# EAGLE design KMO_IO_MV8 (EAGLE 9.1.3)

## Sheet 1 of 2
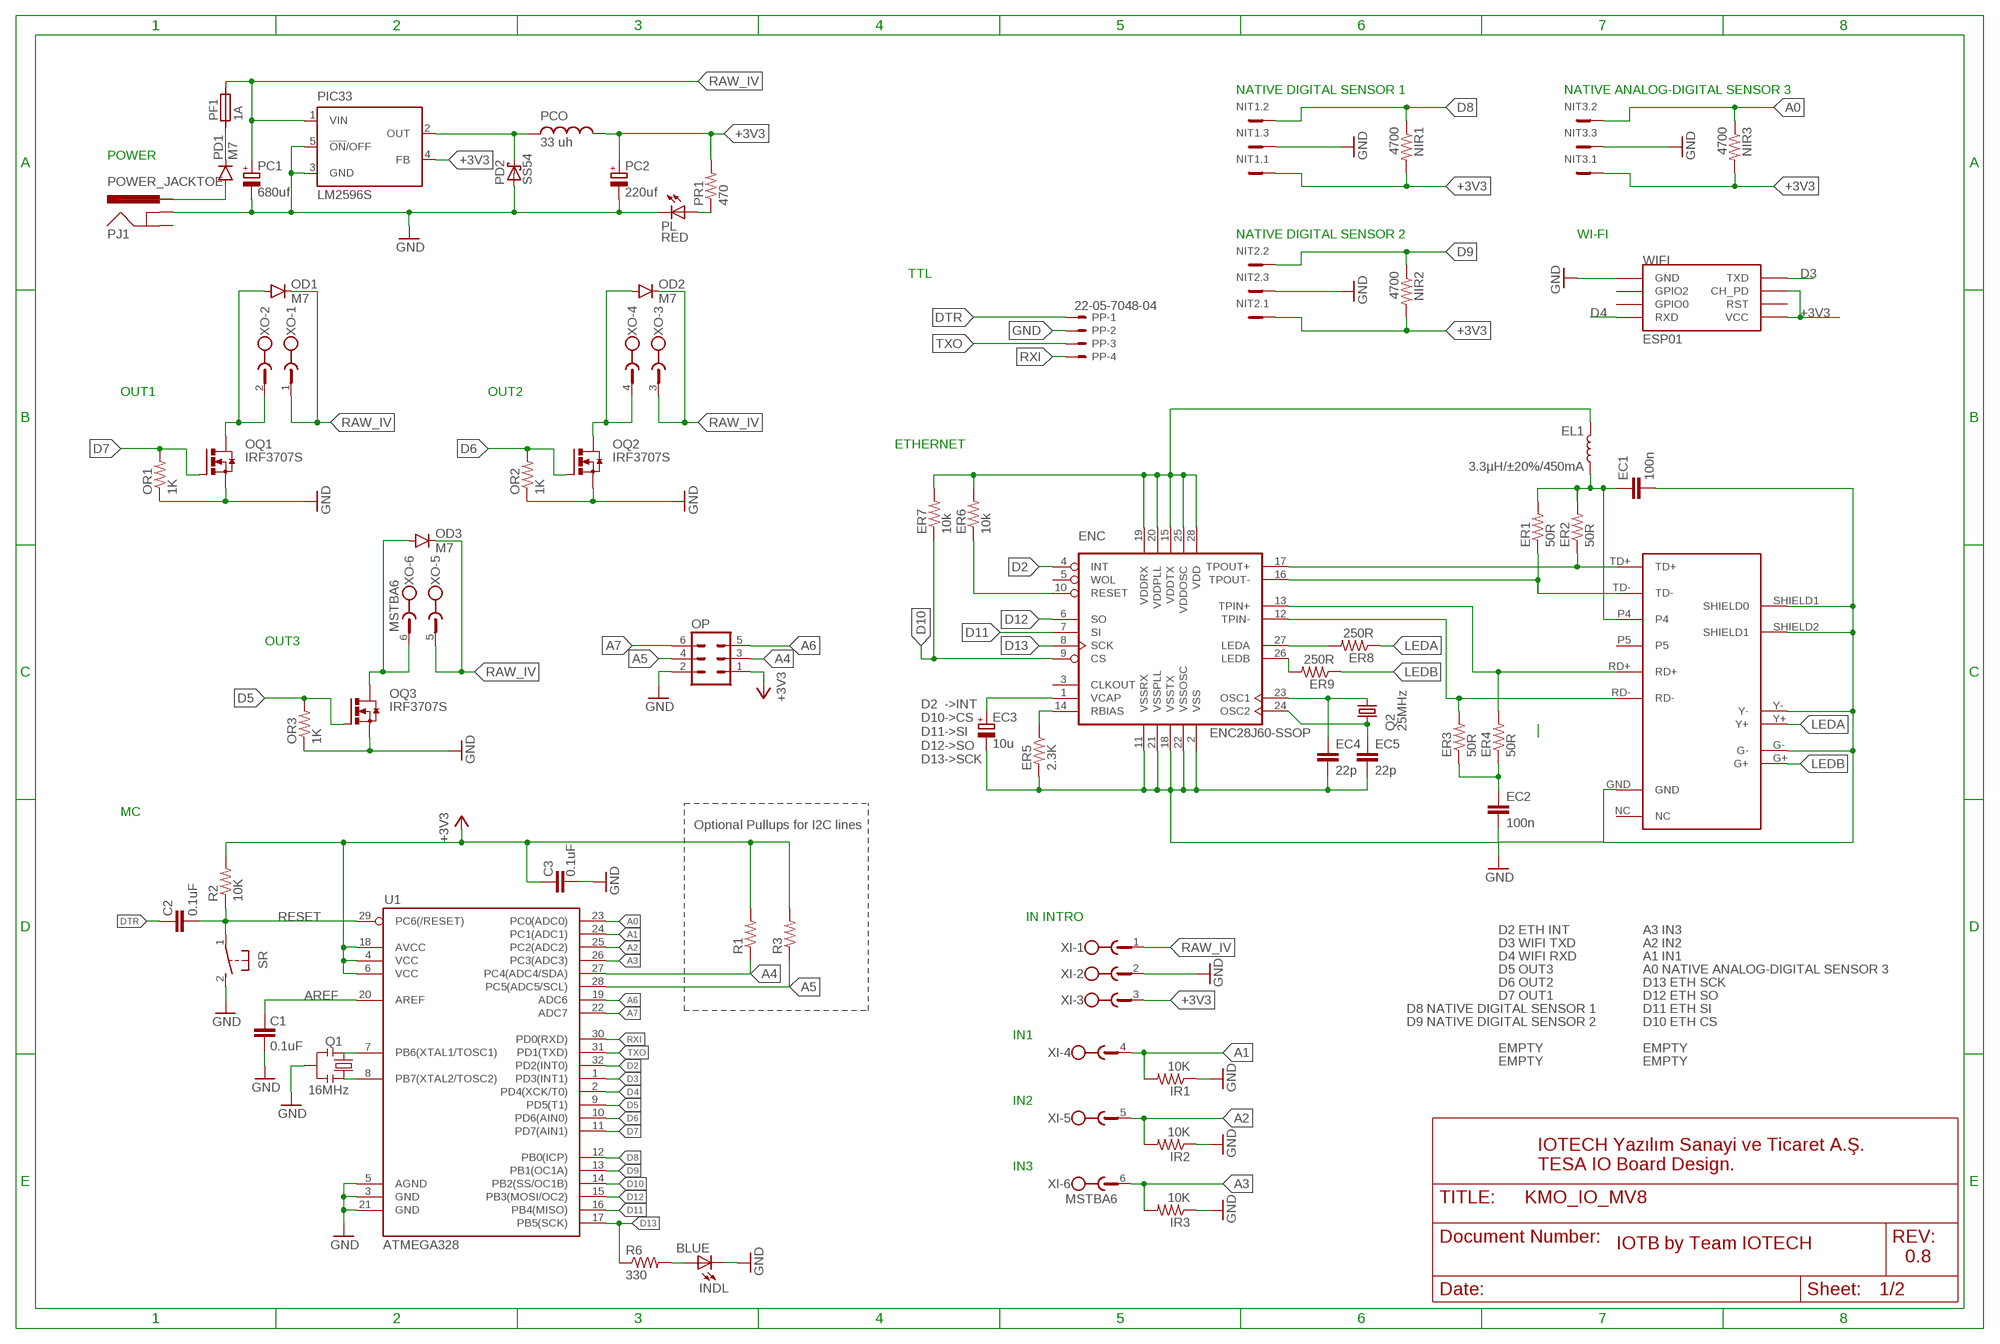
[diagram p0: schematic, sheet 1]

### Parts
C1  0.1uF  CAP0805  [0805]
C2  0.1uF  CAP0805  [0805]
C3  0.1uF  CAP0805  [0805]
EC1  100n  CAP0805  [0805]
EC2  100n  CAP0805  [0805]
EC3  10u  CPOL-EUCT3216  [CT3216]
EC4  22p  CAP0805  [0805]
EC5  22p  CAP0805  [0805]
EL1  3.3µH/±20%/450mA  INDUCTOR-0805-3.3UH  [0805]
ENC  ENC28J60-SSOP  [SSOP28]
ER1  50R  RESISTOR0805-RES  [0805]
ER2  50R  RESISTOR0805-RES  [0805]
ER3  50R  RESISTOR0805-RES  [0805]
ER4  50R  RESISTOR0805-RES  [0805]
ER5  2.3K  RESISTOR0805-RES  [0805]
ER6  10k  RESISTOR0805-RES  [0805]
ER7  10k  RESISTOR0805-RES  [0805]
ER8  250R  RESISTOR0805-RES  [0805]
ER9  250R  RESISTOR0805-RES  [0805]
INDL  BLUE  LEDCHIP-LED0805  [CHIP-LED0805]
IR1  10K  RESISTOR0805-RES  [0805]
IR2  10K  RESISTOR0805-RES  [0805]
IR3  10K  RESISTOR0805-RES  [0805]
NIR1  4700  RESISTOR0805-RES  [0805]
NIR2  4700  RESISTOR0805-RES  [0805]
NIR3  4700  RESISTOR0805-RES  [0805]
NIT1  MC3  [MC3]
NIT2  MC3  [MC3]
NIT3  MC3  [MC3]
OD1  M7  DIODESMA  [SMA-DIODE]
OD2  M7  DIODESMA  [SMA-DIODE]
OD3  M7  DIODESMA  [SMA-DIODE]
OP  MA03-2  [MA03-2]
OQ1  IRF3707S  IRF3704S  [D2PACK]
OQ2  IRF3707S  IRF3704S  [D2PACK]
OQ3  IRF3707S  IRF3704S  [D2PACK]
OR1  1K  RESISTOR0805-RES  [0805]
OR2  1K  RESISTOR0805-RES  [0805]
OR3  1K  RESISTOR0805-RES  [0805]
PC1  680uf  CPOL-EU140CLH-1010  [140CLH-1010]
PC2  220uf  CPOL-EU140CLH-1010  [140CLH-1010]
PCO  33 uh  MSS1260  [MSS1260]
PD1  M7  DIODESMA  [SMA-DIODE]
PD2  SS54  SCHOTTKY-DIODESMD  [SMB]
PF1  1A  SIBA194600  [1820]
PIC33  LM2596S  [TO263-5]
PJ1  POWER_JACKTOE  [POWER_JACK_SMD_OVERPASTE_TOE]
PL  RED  LEDCHIP-LED0805  [CHIP-LED0805]
PP  22-05-7048-04  [7395-04]
PR1  470  RESISTOR0805-RES  [0805]
Q1  16MHz  RESONATOR1:1  [RESONATOR-SMD-1:1]
Q2  25MHz  KX-9B  [5.0X3.2_2]
R1  RESISTOR0805-RES  [0805]
R2  10K  RESISTOR0805-RES  [0805]
R3  RESISTOR0805-RES  [0805]
R6  330  RESISTOR0805-RES  [0805]
SR  31-XX  [B3F-31XX]
U1  ATMEGA328  ATMEGA168  [TQFP32-08]
U$2  HR911105A  [RJ45]
WIFI  ESP01  [ESP01]
XI  MSTBA6  [MSTBA6]
XO  MSTBA6  [MSTBA6]

### Nets
+3V3: C3.2 EL1.1 ENC.15(VDDTX) ENC.19(VDDRX) ENC.20(VDDPLL) ENC.25(VDDOSC) ENC.28(VDD) ER6.2 ER7.2 NIR1.2 NIR2.2 NIR3.2 NIT1.1 NIT2.1 NIT3.1 OP.1 PC2.+ PCO.P$1 PIC33.4(FB) PR1.2 R1.2 R2.2 R3.2 U1.4(VCC) U1.6(VCC) U1.18(AVCC) WIFI.CH_PD WIFI.VCC XI.3
A0: NIR3.1 NIT3.2 U1.23(PC0(ADC0))
A1: IR1.2 U1.24(PC1(ADC1)) XI.4
A2: IR2.2 U1.25(PC2(ADC2)) XI.5
A3: IR3.2 U1.26(PC3(ADC3)) XI.6
A4: OP.3 R1.1 U1.27(PC4(ADC4/SDA))
A5: OP.4 R3.1 U1.28(PC5(ADC5/SCL))
A6: OP.5 U1.19(ADC6)
A7: OP.6 U1.22(ADC7)
AREF: C1.2 U1.20(AREF)
D2: ENC.4(INT) U1.32(PD2(INT0))
D3: U1.1(PD3(INT1)) WIFI.TX(TXD)
D4: U1.2(PD4(XCK/T0)) WIFI.RX(RXD)
D5: OQ3.1(G) OR3.2 U1.9(PD5(T1))
D6: OQ2.1(G) OR2.2 U1.10(PD6(AIN0))
D7: OQ1.1(G) OR1.2 U1.11(PD7(AIN1))
D8: NIR1.1 NIT1.2 U1.12(PB0(ICP))
D9: NIR2.1 NIT2.2 U1.13(PB1(OC1A))
D10: ENC.9(CS) ER7.1 U1.14(PB2(SS/OC1B))
D11: ENC.7(SI) U1.16(PB4(MISO))
D12: ENC.6(SO) U1.15(PB3(MOSI/OC2))
D13: ENC.8(SCK) R6.1 U1.17(PB5(SCK))
DTR: C2.2 PP.1
EP4: EC1.1 EL1.2 ER1.2 ER2.2 U$2.P4
GND: C1.1 C3.1 EC1.2 EC2.2 EC3.- EC4.2 EC5.2 ENC.2(VSS) ENC.11(VSSRX) ENC.18(VSSTX) ENC.21(VSSPLL) ENC.22(VSSOSC) ER5.2 INDL.C IR1.1 IR2.1 IR3.1 NIT1.3 NIT2.3 NIT3.3 OP.2 OQ1.3(S) OQ2.3(S) OQ3.3(S) OR1.1 OR2.1 OR3.1 PC1.- PC2.- PD2.A PIC33.3(GND) PIC33.5(!ON!/OFF) PJ1.GND(GNDBREAK) PL.C PP.2 Q1.2 SR.2(S) U1.3(GND) U1.5(AGND) U1.21(GND) U$2.G- U$2.GND U$2.SHIELD1(SHIELD0) U$2.SHIELD2(SHIELD1) U$2.Y- WIFI.GND XI.2
LEDA: ER8.1 U$2.Y+
LEDB: ER9.1 U$2.G+
N$1: OD3.A OQ3.2(D) XO.6
N$2: PD1.C PF1.1
N$3: OD1.A OQ1.2(D) XO.2
N$4: OD2.A OQ2.2(D) XO.4
N$5: INDL.A R6.2
N$6: EC2.1 ER3.1 ER4.1
N$9: ENC.27(LEDA) ER8.2
N$10: Q1.3 U1.8(PB7(XTAL2/TOSC2))
N$11: PL.A PR1.1
N$13: EC3.+ ENC.1(VCAP)
N$14: ENC.26(LEDB) ER9.2
N$15: Q1.1 U1.7(PB6(XTAL1/TOSC1))
N$16: PCO.P$2 PD2.C PIC33.2(OUT)
N$17: ENC.10(RESET) ER6.1
N$18: PD1.A PJ1.VIN0(PWR)
N$19: ENC.14(RBIAS) ER5.1
N$22: EC5.1 ENC.24(OSC2) Q2.1
N$24: EC4.1 ENC.23(OSC1) Q2.2
RAW_IV [vcc]: OD1.C OD2.C OD3.C PC1.+ PF1.2 PIC33.1(VIN) XI.1 XO.1 XO.3 XO.5
RD+: ENC.13(TPIN+) ER4.2 U$2.RD+
RD-: ENC.12(TPIN-) ER3.2 U$2.RD-
RESET: C2.1 R2.1 SR.1(P) U1.29(PC6(/RESET))
RXI: PP.4 U1.30(PD0(RXD))
TD+: ENC.17(TPOUT+) ER2.1 U$2.TD+
TD-: ENC.16(TPOUT-) ER1.1 U$2.TD-
TXO: PP.3 U1.31(PD1(TXD))
Unconnected: ENC.3(CLKOUT) ENC.5(WOL) PJ1.P$4(GND) U$2.NC U$2.P5 WIFI.GPIO0 WIFI.GPIO2 WIFI.RST

### Notes on the sheet
- NATIVE DIGITAL SENSOR 1 | NATIVE ANALOG-DIGITAL SENSOR 3
- POWER
- NATIVE DIGITAL SENSOR 2 | WI-FI
- TTL
- OUT1 | OUT2
- ETHERNET
- OUT3
- D2  ->INT
  D10->CS
  D11->SI
  D12->SO
  D13->SCK
- MC
- Optional Pullups for I2C lines
- IN INTRO
- D2 ETH INT | A3 IN3
- D3 WIFI TXD | A2 IN2
- D4 WIFI RXD | A1 IN1
- D5 OUT3 | A0 NATIVE ANALOG-DIGITAL SENSOR 3
- D6 OUT2 | D13 ETH SCK
- D7 OUT1 | D12 ETH SO
- D8 NATIVE DIGITAL SENSOR 1 | D11 ETH SI
- D9 NATIVE DIGITAL SENSOR 2 | D10 ETH CS
- IN1
- EMPTY | EMPTY
- EMPTY | EMPTY
- IN2
- IN3
- IOTECH Yazılım Sanayi ve Ticaret A.Ş.
  TESA IO Board Design.
- IOTB by Team IOTECH
- 0.8

## Sheet 2 of 2
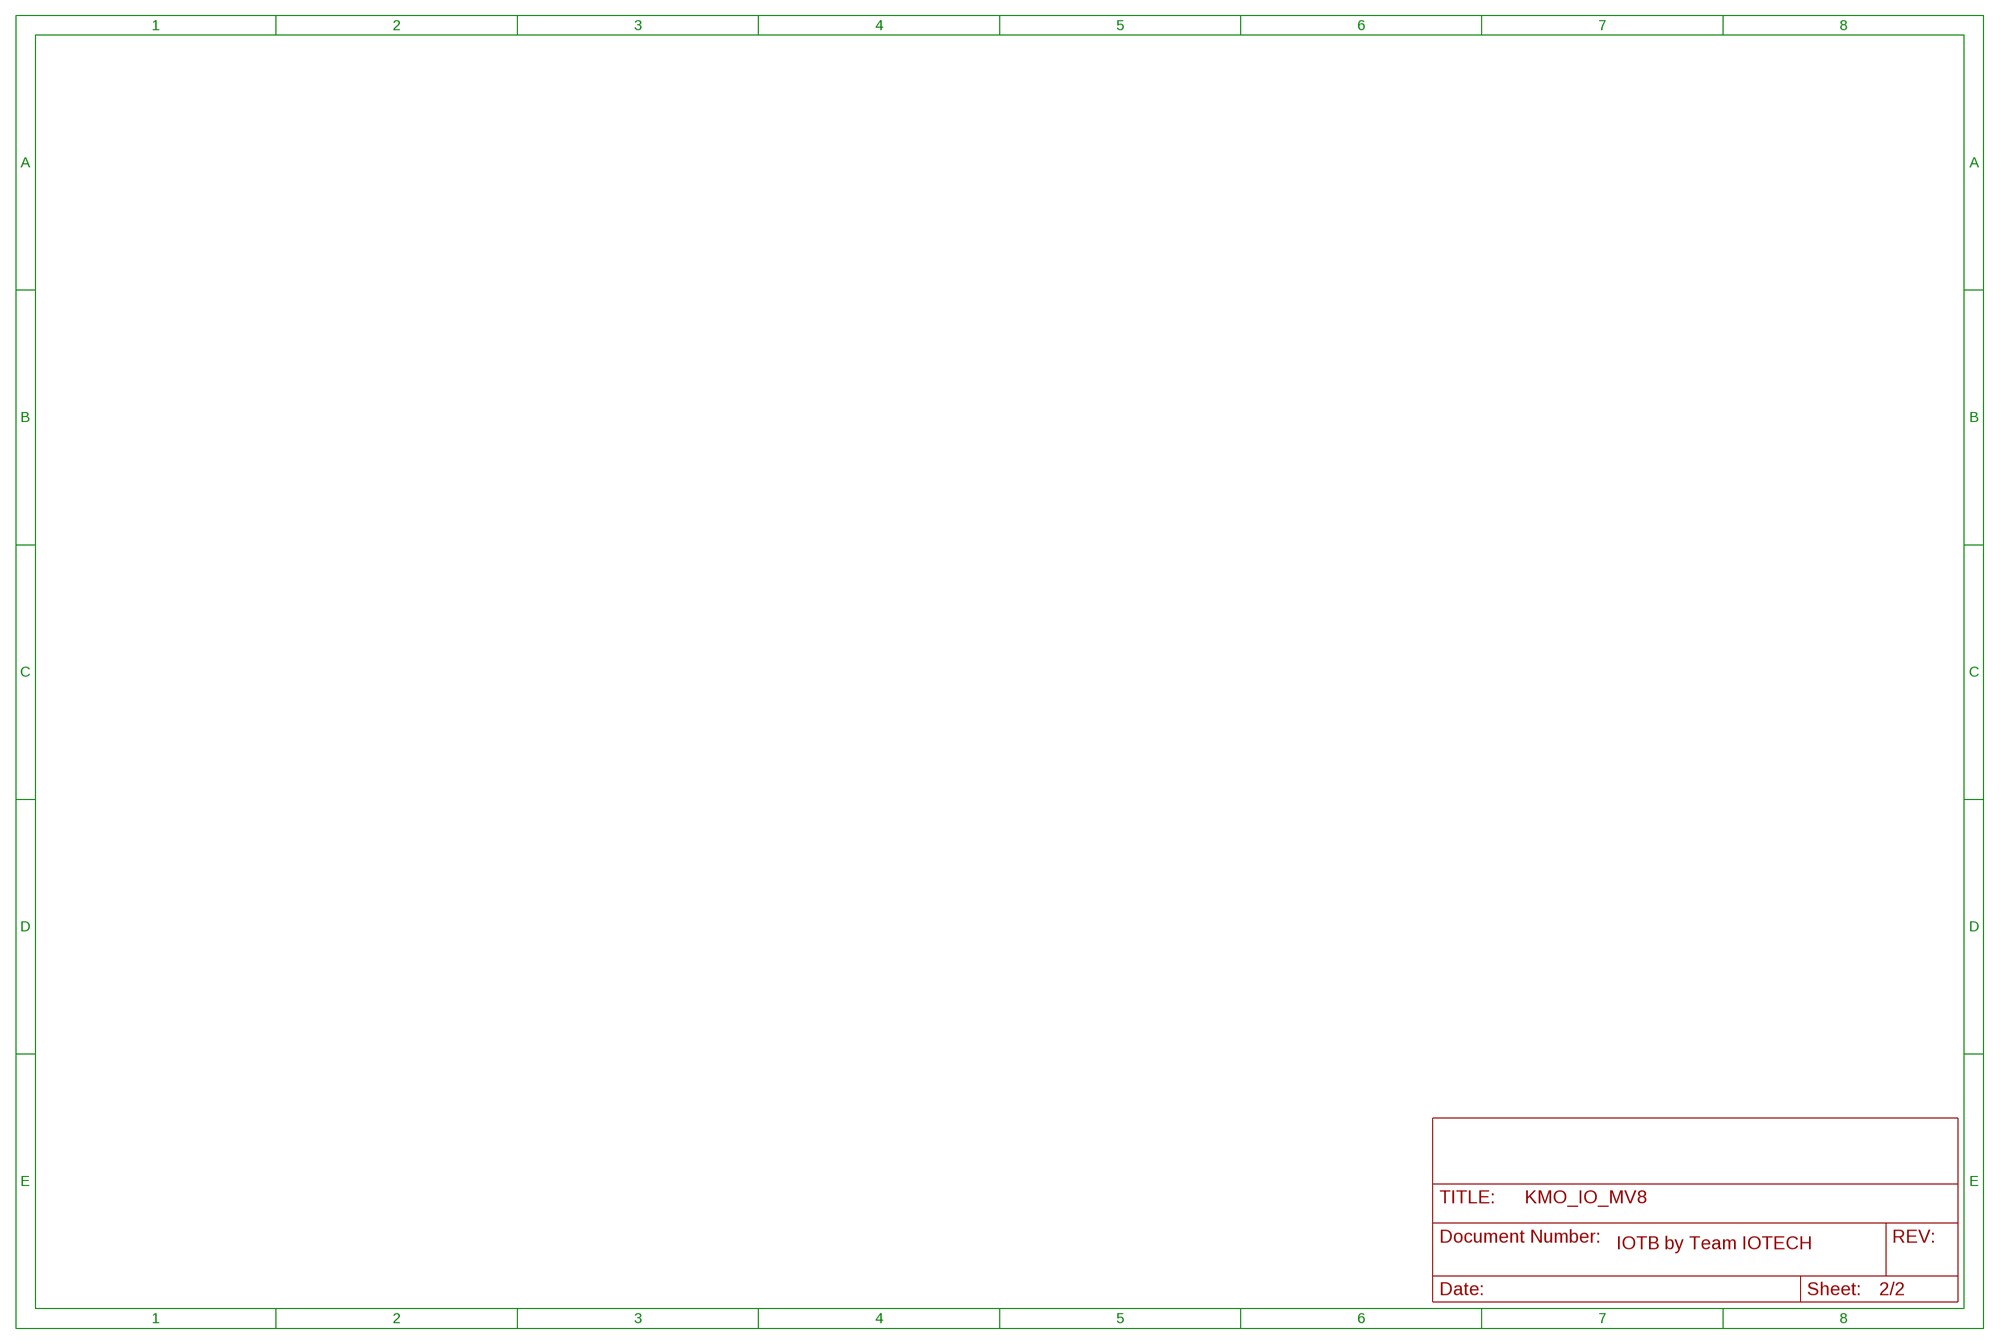
[diagram p1: schematic, sheet 2]

### Notes on the sheet
- IOTB by Team IOTECH

## Library data of the parts
C1-C3 EC1 EC2 EC4 EC5 = SparkFun-Passives:CAP: Capacitor Standard 0603 ceramic capacitor, and 0.1" leaded capacitor.
EC3 PC1 PC2 = rcl:CPOL-EU: POLARIZED CAPACITOR, European symbol; SPICEPREFIX: C
EL1 = SparkFun-Coils:INDUCTOR: Inductors Resist changes in electrical current. Basically a coil of wire. SparkFun Products: SparkFun Load Cell Amplifier - HX711 <https://www.sparkfun.com/products/13879> IOIO-OTG - V2.2 <https://www.sparkfun.com/products/13613>; PROD_ID: NDUC-13076
ENC = microchip-enc28j60:ENC28J60-*: Microchip 10Mbit Eth. contoller with SPI interface
ER1-ER9 IR1-IR3 NIR1-NIR3 OR1-OR3 PR1 R1-R3 R6 = SparkFun-Passives:RESISTOR: Resistor Basic schematic elements and footprints for 0603, 1206, and PTH resistors.
INDL PL = led:LED: LED OSRAM: - CHIPLED LG R971, LG N971, LY N971, LG Q971, LY Q971, LO R971, LY R971 LH N974, LH R974 LS Q976, LO Q976, LY Q976 LO Q996 - Hyper CHIPLED LW Q18S LB Q993, LB Q99A, LB R99A - SideLED LS A670, LO A670, LY A670, LG A670, LP A670 LB A673, LV A673, LT A673, LW A673 LH A674 LY A675 LS A676, LA A676, LO A676, LY A676, LW A676 LS A679, LY A679, LG A679 - Hyper Micro SIDELED® LS Y876, LA Y876, LO Y876, LY Y876 LT Y87S - SmartLED LW L88C, LW L88S LB L89C, LB L89S, LG L890 LS L89K, LO L89K, LY L89K LS L896, LA L896, LO L896, LY L896 - TOPLED LS T670, LO T670, LY T670, LG T670, LP T670 LSG T670, LSP T670, LSY T670, LOP T670, LYG T670 LG T671, LOG T671, LSG T671 LB T673, LV T673, LT T673, LW T673 LH T674 LS T676, LA T676, LO T676, LY T676, LB T676, LH T676, LSB T676, LW T676 LB T67C, LV T67C, LT T67C, LS T67K, LO T67K, LY T67K, LW E67C LS E67B, LA E67B, LO E67B, LY E67B, LB E67C, LV E67C, LT E67C LW T67C LS T679, LY T679, LG T679 LS T770, LO T770, LY T770, LG T770, LP T770 LB T773, LV T773, LT T773, LW T773 LH T774 LS E675, LA E675, LY E675, LS T675 LS T776, LA T776, LO T776, LY T776, LB T776 LHGB T686 LT T68C, LB T68C - Hyper Mini TOPLED® LB M676 - Mini TOPLED Santana® LG M470 LS M47K, LO M47K, LY M47K Source: http://www.osram.convergy.de LUXEON: - LUMILED® LXK2-PW12-R00, LXK2-PW12-S00, LXK2-PW14-U00, LXK2-PW14-V00 LXK2-PM12-R00, LXK2-PM12-S00, LXK2-PM14-U00 LXK2-PE12-Q00, LXK2-PE12-R00, LXK2-PE12-S00, LXK2-PE14-T00, LXK2-PE14-U00 LXK2-PB12-K00, LXK2-PB12-L00, LXK2-PB12-M00, LXK2-PB14-N00, LXK2-PB14-P00, LXK2-PB14-Q00 LXK2-PR12-L00, LXK2-PR12-M00, LXK2-PR14-Q00, LXK2-PR14-R00 LXK2-PD12-Q00, LXK2-PD12-R00, LXK2-PD12-S00 LXK2-PH12-R00, LXK2-PH12-S00 LXK2-PL12-P00, LXK2-PL12-Q00, LXK2-PL12-R00 Source: www.luxeon.com KINGBRIGHT: KA-3528ASYC Source: www.kingbright.com
NIT1-NIT3 = con-phoenix-381_l:MC3: Mini-Combicon 3.81mm horizontal 3-polig (ohne Gegenstecker)
OD1-OD3 PD1 = SparkFun-DiscreteSemi:DIODE: Diode These are standard reverse protection diodes and small signal diodes. SMA package can handle up to about 1A. SOD-323 can handle about 200mA. What the SOD-323 package when ordering, there are some mfgs out there that are 5-pin packages.
OP = con-lstb:MA03-2: PIN HEADER; OC_FARNELL: unknown; OC_NEWARK: unknown
OQ1-OQ3 = transistor-power:IRF3704: SMPS MOSFET HEXFET® Power MOSFET Source: http://www.irf.com/product-info/datasheets/data/irf3704.pdf
PCO = inductor-coilcraft:MSS1260: SMT Power Inductor
PD2 = diode:SCHOTTKY-DIODE: Schottky Diode
PF1 = _hhn_PtcFuses_Siba_r500_Ozan:SIBA194600*: SIBA PTC-Fuses, Series 194600, 1812 (4.5 3.2)mm Source: www.siba.de/ Package: SMD 1812 (4.5 x 3.2)mm Technologies: SIBA194600Axxx xxx: Trip-Current * 10 mA Author: Dipl.-Ing. FH Rainer Bayer
PIC33 = national-semiconductor:LM2596: SIMPLE SWITCHER® Power Converter 150 kHz 3A Step-Down Voltage Regulator Source: http://www.national.com/ds/LM/LM2596.pdf; MF: NATIONAL SEMICONDUCTOR; MPN: LM2596S-ADJ/NOPB; OC_FARNELL: 9494367; OC_NEWARK: 41K3842
PJ1 = SparkFun-Connectors:POWER_JACK: Power Jack Connector This is the standard 5.5mm barrel jack for power. The PTH is the most common, proven, reliable, footprint. The Slot footprint only works if the mill layer is transmitted to the PCB fab house so be warned. Here are the connectors we sell at SparkFun: DC Barrel Power Jack/Connector <https://www.sparkfun.com/products/119> (PRT-00119) DC Barrel Power Jack/Connector (SMD) <https://www.sparkfun.com/products/12748> (PRT-12748) DC Barrel Jack Adapter - Breadboard Compatible <https://www.sparkfun.com/products/10811> (PRT-10811) It is used on this SparkFun product (and many, many others): SparkFun RedBoard - Programmed with Arduino <https://www.sparkfun.com/products/12757> (DEV-12757) Also, if you need a mating power supply or connector, please check these out: Wall Adapter Power Supply - 9VDC 650mA <https://www.sparkfun.com/products/298> (TOL-00298) DC Barrel Jack Adapter - Male <https://www.sparkfun.com/products/10287> (PRT-10287); PROD_ID: CONN-08106; SF_ID: PRT-12748
PP = con-molex:22-?-04: CONNECTOR wire to board 2.54 mm (.1 inch) pitch header; MF: MOLEX; OC_FARNELL: unknown; OC_NEWARK: unknown
Q1 = Testing:RESONATOR: Resonator Small SMD resonator. This is the itty bitty 10/20MHz resonators with built in caps. CSTCE10M0G55 and CSTCE20M0V53. Footprint for SMD has been used in SFE production for years, and does work okay. 1:1 is an attempt to get larger fillets on the sides so it will be easier to inspect these solders in our AOI machine. The pads have been minimized to match the actual metal under the resonator. To see this relation, it includes an image import of the bottom side of the component. Imported to scale on layer 200.
Q2 = crystal-geyer_V1_0:KX: Quartz Crystals (MHz) SMD: KX - Serie Model Size l/w/h [mm] Frequency Range Frequency Stability Temp. Range [°C] Load Capacitance AECQ 200 availabel Datasheet KX-4 KX-5 KX-6 KX-7 KX-9A KX-9B KX-12A KX-12B KX-13 KX-20 KX-K KX-KS 1.6/1.2/0.3 2.0/1.6/0.45 2.5/2.0/0.55 3.2/2.5/0.8 5.0/3.2/1.0 5.0/3.2/1.1 6.0/3.5/1.1 6.0/3.5/1.0 7.0/5.0 /1.3 11.6/5.5/1.6 12.3/4.5/4.2 12.3/4.5/3.2 24.0 ~ 80.0 MHz 16.0 ~ 80.0 MHz 12.0 ~ 80.0 MHz 8.0 ~ 60.0 MHz 7,68 ~ 300,0 MHz 8,0 ~ 50,0 MHz 8,0 ~ 150,0 MHz 8,0 ~ 50,0 MHz 6,0 ~ 160,0 MHz 3,579 ~ 25,0 MHz 3,579 ~ 70,0 MHz 3,579 ~ 70,0 MHz ±10 … ±50ppm ±10 … ±50ppm ±10 … ±50ppm ±10 … ±50ppm ±10 … ±50ppm ±10 … ±50ppm ±10 … ±50ppm ±10 … ±50ppm ±10 … ±50ppm ±50ppm ±10 … ±50ppm ±10 … ±50ppm (*) -40°C …+85°C (*) -40°C …+125°C (*) -40°C …+125°C (*) -40°C …+125°C (*) -40°C …+105°C (*) -40°C …+105°C (*) -40°C …+125°C (*) -40°C …+105°C (*) -40°C …+105°C (*) -40°C …+105°C (*) -40°C …+85°C (*) -40°C …+85°C 8, 8…16 8, 8…16 10, 8…16 12, 7…20 16, 10…20 16, 10…20 16, 10…20 16, 12…20 16, 12…20 16, 12…20 16, 12…30 16, 12…30 - yes yes yes - - - - - - - - KX-4.pdf <http://www.geyer-electronic.de/uploads/tx_userartikelfrequenz/GEYER-KX-4.pdf> KX-5.pdf <http://www.geyer-electronic.de/uploads/tx_userartikelfrequenz/GEYER-KX-5.pdf> KX-6.pdf <http://www.geyer-electronic.de/uploads/tx_userartikelfrequenz/GEYER-KX-6.pdf> KX-7.pdf <http://www.geyer-electronic.de/uploads/tx_userartikelfrequenz/GEYER-KX-7.pdf> KX-9A.pdf <http://www.geyer-electronic.de/uploads/tx_userartikelfrequenz/GEYER-KX-9A.pdf> KX-9B.pdf <http://www.geyer-electronic.de/uploads/tx_userartikelfrequenz/GEYER-KX-9B.pdf> KX-12A.pdf <http://www.geyer-electronic.de/uploads/tx_userartikelfrequenz/GEYER-KX-12A.pdf> KX-12B.pdf <http://www.geyer-electronic.de/uploads/tx_userartikelfrequenz/GEYER-KX-12B.pdf> KX-13.pdf <http://www.geyer-electronic.de/uploads/tx_userartikelfrequenz/GEYER-KX-13.pdf> KX-20.pdf <http://www.geyer-electronic.de/uploads/tx_userartikelfrequenz/GEYER-KX-20.pdf> KX-K.pdf <http://www.geyer-electronic.de/uploads/tx_userartikelfrequenz/GEYER-KX-K.pdf> KX-KS.pdf <http://www.geyer-electronic.de/uploads/tx_userartikelfrequenz/GEYER-KX-KS.pdf> <http://www.geyer-electronic.de/fileadmin/template/img/logo-geyer-electronic.png> Details see: http://www.geyer-electronic.de/Frequenz-Produkte.9.0.html Created 2016-06-07, Hans Locher 2016 (C) Geyer Quartz Technology KX4,KX5,KX6,KX7,KX9A,KX9B,KX12A,KX12B,KX13,KX20,KXK,KXKS;1612;2016;2520;3225;5032;6035;7050;11655;12345;1,6x1,2;2,0x1,6;2,5x2,0;3,2x2,5;5,0x3,2;6,0x3,5;7,0x5,0;11,6x5,5;12,3x4,5;12,3x4,5;1.6x1.2;2.0x1.6;2.5x2.0;3.2x2.5;5.0x3.2;6.0x3.5;7.0x5.0;11.6x5.5;12.3x4.5;12.3x4.5;
SR = switch-omron:31-XX: OMRON SWITCH; MPN: B3F-3100; OC_FARNELL: 959704; OC_NEWARK: 36M3582
U1 = SparkFun:ATMEGA168
U$2 = HR911105A:HR911105A
WIFI = esp8266modules:ESP01: ESP8266 Wifi module 01
XI XO = con-phoenix-508:MSTBA6: PHOENIX; MF: FARNELL; MPN: 1757284; OC_FARNELL: 3705213; OC_NEWARK: 71C4165

## Net classes
0 default: width 0.203 mm, drill 0.3 mm, clearance 0.16 mm
1 vcc: width 0.254 mm, drill 0.3 mm, clearance 0.16 mm

## Board
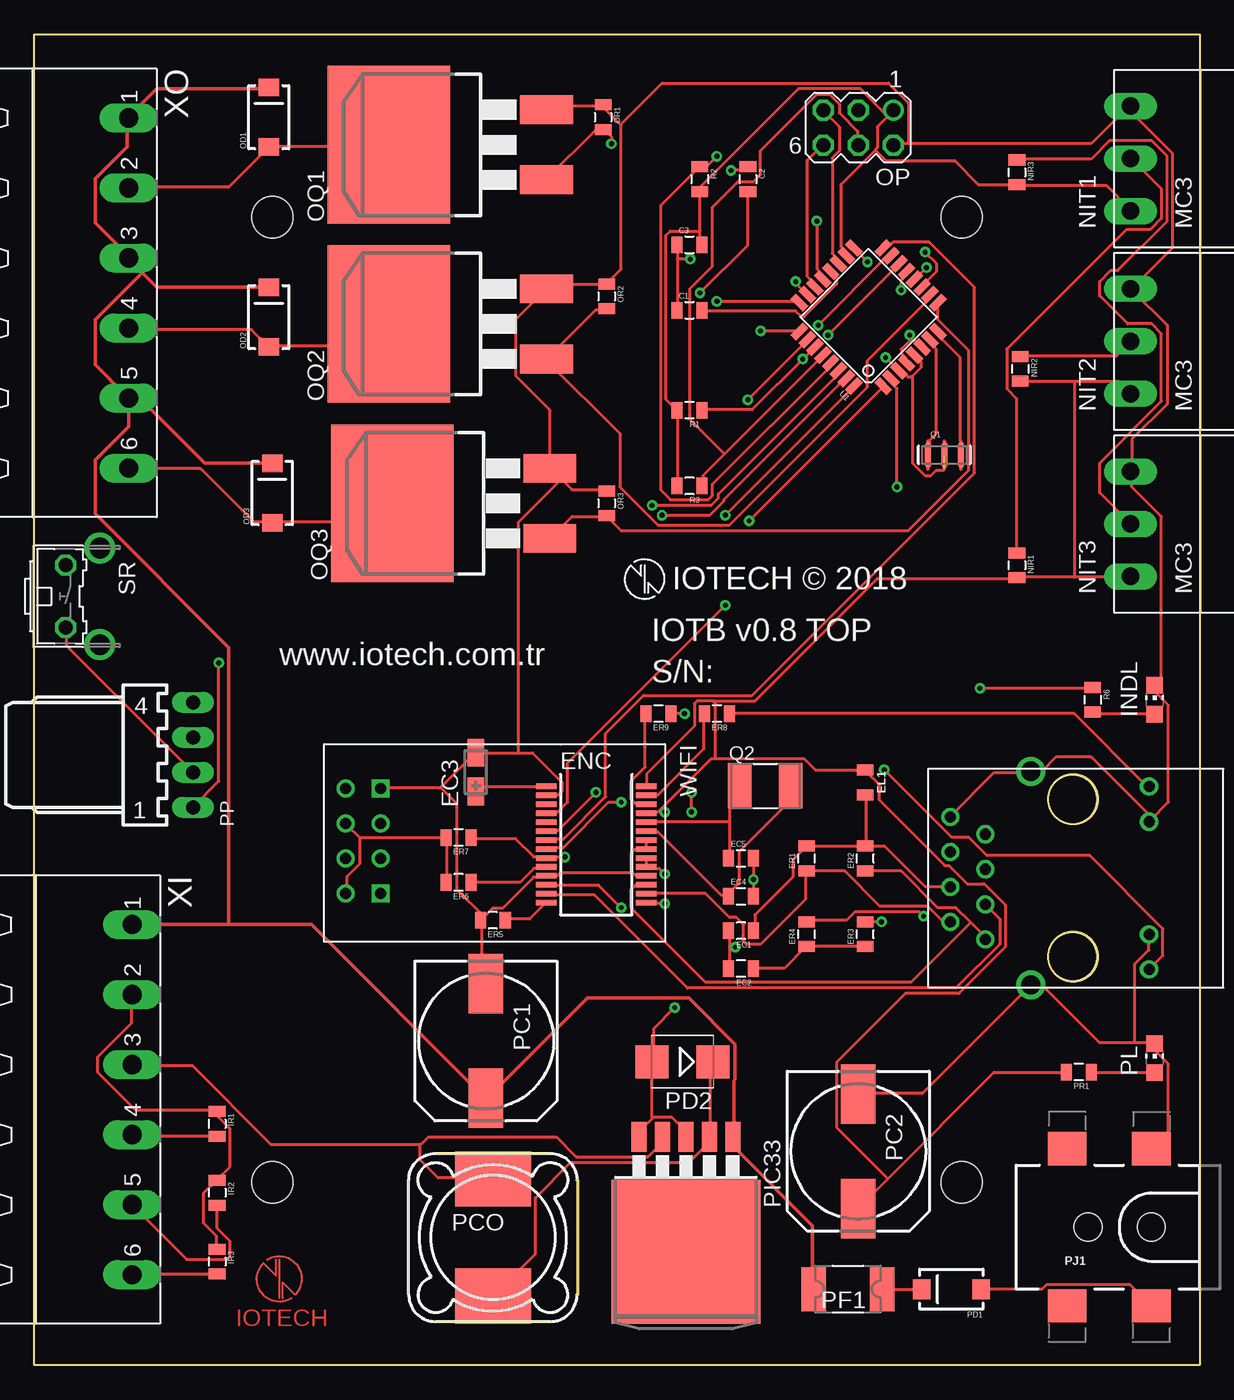
[diagram p2: board, top side]
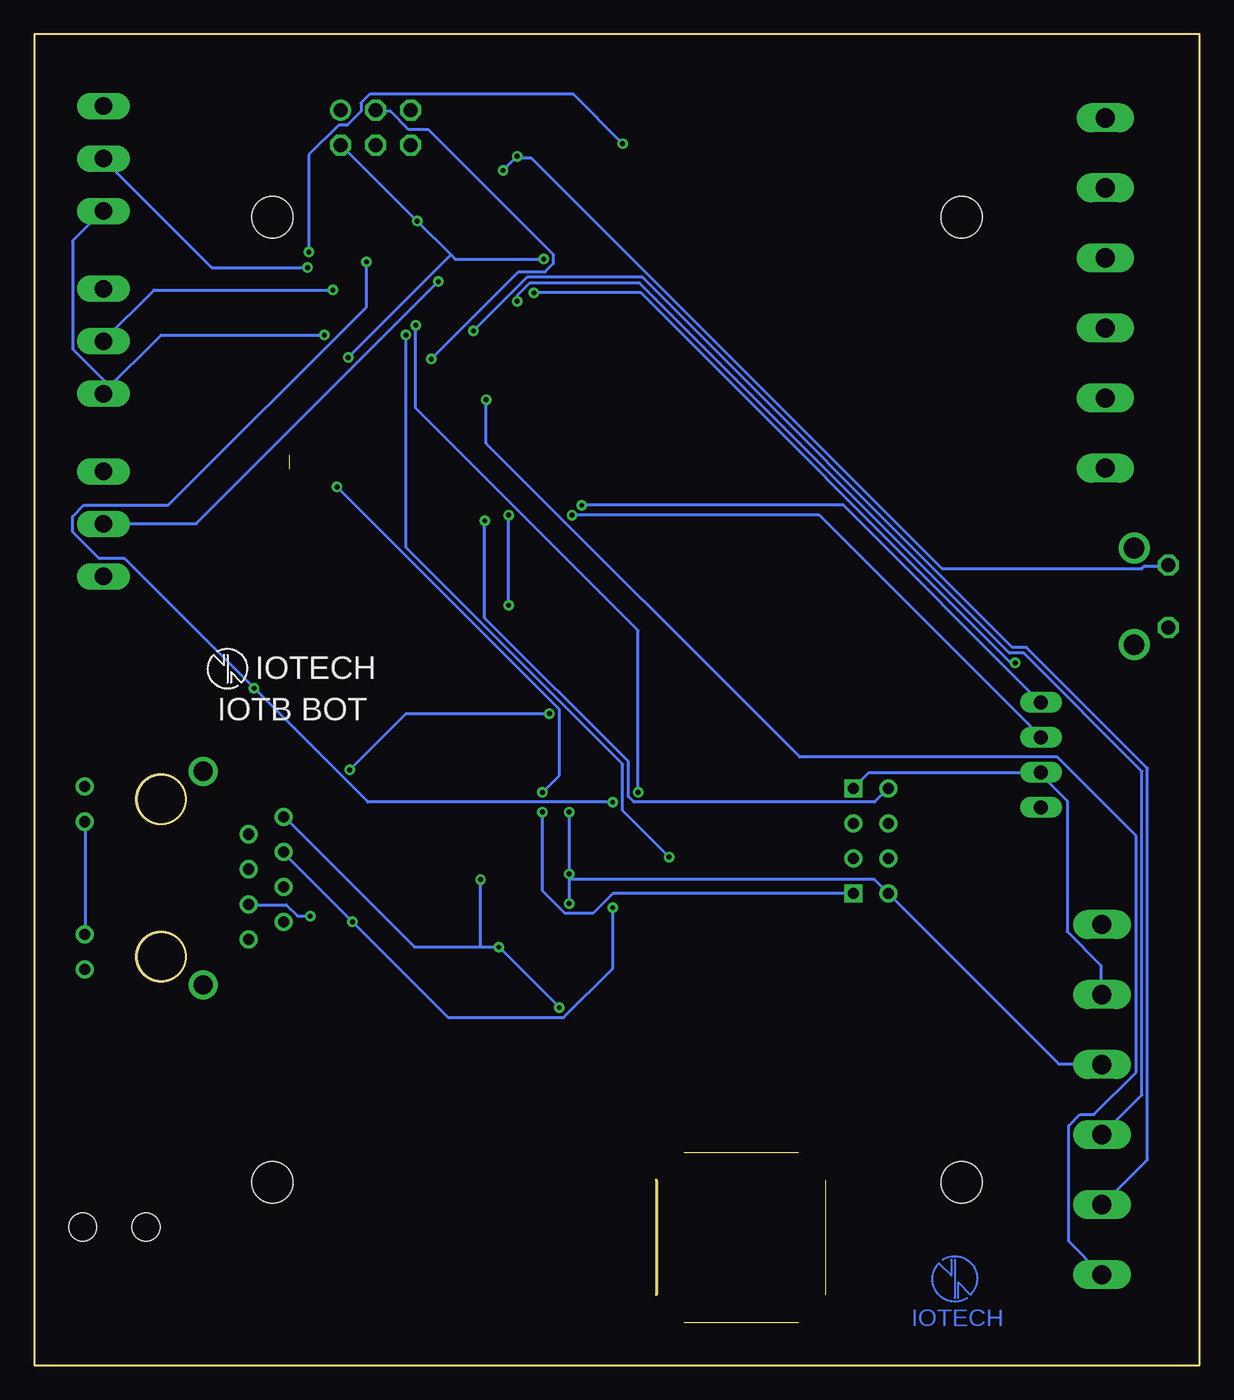
[diagram p3: board, bottom side, seen from below]

Size 84.5 x 96.5 mm. Coordinates in mm from the lower left corner, seen from the top.
Outline: 0,0 0,96.5 84.5,96.5 84.5,0 0,0
Copper layers (1*16): Top 0.035mm / dielectric 1.5mm / Bottom 0.035mm
Design rules "KMO_IO_M": minimum track width 6mil, minimum drill 0.35mm, track to track 0.205mm, track to pad 0.205mm, pad to pad 0.205mm, via to via 0.205mm, smd to smd 6mil, copper to edge 40mil, drill to drill 6mil, minimum pad ring 10mil, minimum via ring 8mil, stop-mask expansion 4mil, vias tented up to drill 0mil, thermal gap 10mil
Holes 3 mm at 17.25,83.25 67.25,83.25 17.25,13.25 67.25,13.25

### Footprints (pad centres in the part's own frame; a part is rotated, then mirrored left to right if it is on the bottom)
0805 = smd 0.8 x 1.2: 1 -0.9,0; 2 0.9,0
CT3216 = smd 2 x 1.2: + -1.4,0; - 1.4,0
SSOP28 = smd 0.4 x 1.5: 1 -4.225,-3.625; 2 -3.575,-3.625; 3 -2.925,-3.625; 4 -2.275,-3.625; 5 -1.625,-3.625; 6 -0.975,-3.625; 7 -0.325,-3.625; 8 0.325,-3.625; 9 0.975,-3.625; 10 1.625,-3.625; 11 2.275,-3.625; 12 2.925,-3.625; 13 3.575,-3.625; 14 4.225,-3.625; 15 4.225,3.625; 16 3.575,3.625; 17 2.925,3.625; 18 2.275,3.625; 19 1.625,3.625; 20 0.975,3.625; 21 0.325,3.625; 22 -0.325,3.625; 23 -0.975,3.625; 24 -1.625,3.625; 25 -2.275,3.625; 26 -2.925,3.625; 27 -3.575,3.625; 28 -4.225,3.625
CHIP-LED0805 = smd 1.2 x 1.2: A 0,-1.05; C 0,1.05
MC3 = drill 1.27 long: 1 -3.81,0; 2 0,0; 3 3.81,0
SMA-DIODE = smd 1.27 x 1.47: A -2.15,0; C 2.15,0
MA03-2 = drill 1.016: 1 -2.54,-1.27 | drill 1.016 octagon: 2 -2.54,1.27; 3 0,-1.27; 4 0,1.27; 5 2.54,-1.27; 6 2.54,1.27
D2PACK = smd 2.083 x 3.81: 1 -2.54,-8.89; 3 2.54,-8.89 | smd 11.43 x 8.89: 2 0,2.54
140CLH-1010 = smd 4.3 x 2.5: + 4.15,0; - -4.15,0
MSS1260 = smd 5.5 x 4: P$1 0,4.25; P$2 0,-4.25
SMB = smd 2.4 x 2.4: A 2.2,0; C -2.2,0
1820 = smd 1.78 x 3.2: 1 -2.49,0; 2 2.49,0
TO263-5 = smd 1.067 x 2.159: 1 -3.404,-5.791; 2 -1.702,-5.791; 3 0,-5.791; 4 1.702,-5.791; 5 3.404,-5.791 | smd 10.8 x 10.41: 6 0,2.54
POWER_JACK_SMD_OVERPASTE_TOE = smd 2.8 x 2.4: GND 0,-5.7; P$4 6.1,-5.7; VIN0 0,5.7; VIN1 6.1,5.7 | hole 2.032: 0,0; 4.572,0
7395-04 = drill 1.016 long: 1 3.81,0; 2 1.27,0; 3 -1.27,0; 4 -3.81,0
RESONATOR-SMD-1:1 = smd 0.45 x 1.905: 1 -1.2,0; 2 0,0; 3 1.2,0
5.0X3.2_2 = smd 1.7 x 3.3: 1 -1.85,0; 2 1.85,0
B3F-31XX = drill 1.016 octagon: 1 -2.261,-1.245; 2 2.261,-1.245 | drill 1.499 pad 2.159: 3 -3.505,1.245; 4 3.505,1.245
TQFP32-08 = smd 1.27 x 0.559: 1 -4.293,2.8; 2 -4.293,2; 3 -4.293,1.2; 4 -4.293,0.4; 5 -4.293,-0.4; 6 -4.293,-1.2; 7 -4.293,-2; 8 -4.293,-2.8; 17 4.293,-2.8; 18 4.293,-2; 19 4.293,-1.2; 20 4.293,-0.4; 21 4.293,0.4; 22 4.293,1.2; 23 4.293,2; 24 4.293,2.8 | smd 0.559 x 1.27: 9 -2.8,-4.293; 10 -2,-4.293; 11 -1.2,-4.293; 12 -0.4,-4.293; 13 0.4,-4.293; 14 1.2,-4.293; 15 2,-4.293; 16 2.8,-4.293; 25 2.8,4.293; 26 2,4.293; 27 1.2,4.293; 28 0.4,4.293; 29 -0.4,4.293; 30 -1.2,4.293; 31 -2,4.293; 32 -2.8,4.293
RJ45 = drill 0.8: G+ 5.84,-6.305; G- 5.84,-3.765; GND -8.57,4.76; NC -6.03,3.5; P4 -8.57,-0.32; P5 -6.03,0.96; RD+ -6.03,-1.58; RD- -8.57,2.22; TD+ -6.03,-4.12; TD- -8.57,-2.86; Y+ 5.84,6.945; Y- 5.84,4.405 | drill 1.4: SHIELD1 -2.73,-7.425; SHIELD2 -2.73,8.065 | hole 3.5: 0.3,-5.38; 0.3,6.02
ESP01 = drill 0.8: CH_PD -1.285,-8.178; GPIO0 1.255,-5.638; GPIO2 -1.285,-5.638; RST 1.255,-8.178; TX -3.825,-8.178; VCC 3.795,-8.178 | drill 0.8 square: GND -3.825,-5.638; RX 3.795,-5.638
MSTBA6 = drill 1.397 long: 1 -12.7,5.08; 2 -7.62,5.08; 3 -2.54,5.08; 4 2.54,5.08; 5 7.62,5.08; 6 12.7,5.08

### Placement (x,y rotation side)
C1  47.5,76.5 0 top
C2  51.75,86 270 top
C3  47.5,81.25 0 top
EC1  51.25,31.5 180 top
EC2  51.25,28.75 180 top
EC3  32,43 90 top
EC4  51.25,34 0 top
EC5  51.25,36.75 0 top
EL1  60.25,42.25 270 top
ENC  40.75,37.75 270 top
ER1  56,36.75 90 top
ER2  60.25,36.75 90 top
ER3  60.25,31.25 90 top
ER4  56,31.25 90 top
ER5  33.25,32.25 180 top
ER6  30.75,35 180 top
ER7  30.75,38.25 180 top
ER8  49.5,47.25 180 top
ER9  45.25,47.25 180 top
INDL  81.25,48.25 0 top
IR1  13.25,17.5 270 top
IR2  13.25,12.5 270 top
IR3  13.25,7.5 270 top
NIR1  71.25,58 270 top
NIR2  71.5,72.25 270 top
NIR3  71.25,86.5 270 top
NIT1  79.5,87.5 90 top
NIT2  79.5,74.25 90 top
NIT3  79.5,61 90 top
OD1  17,90.5 90 top
OD2  17,76 90 top
OD3  17.25,63.25 90 top
OP  59.75,89.75 180 top
OQ1  28.25,88.5 90 top
OQ2  28.25,75.5 90 top
OQ3  28.5,62.5 90 top
OR1  41.25,90.5 270 top
OR2  41.5,77.5 270 top
OR3  41.5,62.5 270 top
PC1  32.75,23.5 270 top
PC2  59.75,15.5 270 top
PCO  33.25,9.25 0 top
PD1  66.5,5.5 180 top
PD2  47,22 180 top
PF1  59,5.5 180 top
PIC33  47.25,10.75 180 top
PJ1  81,10 180 top
PL  81.25,22.25 0 top
PP  11.5,44.25 270 top
PR1  75.75,21.25 180 top
Q1  66,66 0 top
Q2  53,42 0 top
R1  47.5,69.25 180 top
R2  48.25,86 270 top
R3  47.5,63.75 180 top
R6  76.75,48.25 270 top
SR  3.5,55.75 270 top
U1  60.5,76 135 top
U$1  [IOTECH_COPPER_W_TEXT]  17.75,6.25 0 top
U$2  75,35 0 top
U$4  [IOTECH_COPPER_W_TEXT]  17.75,6.25 0 bottom
WIFI  30.75,38 270 top
XI  2,19.25 270 top
XO  1.75,77.75 270 top

### Tracks (layer width: path | path; a pad name or v marks a point on that pad's centre or on a via)
+3V3  (via drill 0.35)
  Top 0.203: 75.42,57.15 79.5,57.15 NIT3.1 | 75.42,57.15 71.33,57.15 NIR1.2 71.23,57.05 61.13,57.05 52.25,48.17 49.29,48.17 49.24,48.12 | 63.48,74.29 62.86,73.68 62.86,73.37 63.17,73.07 63.17,72.76 U1.4 | 63.48,74.29 63.88,74.29 64.29,73.88 U1.6 | 75.42,71.33 78.68,71.33 79.5,70.52 NIT2.1 | 75.42,71.33 71.54,71.33 NIR2.2 | v63.48,74.7 63.48,74.29 | 75.42,71.33 75.42,57.15 | 48.27,82.25 48.27,81.44 48.37,81.33 C3.2 | 48.27,82.25 48.27,85.01 R2.2 48.27,85.11 48.27,85.42 55.41,92.56 59.9,92.56 61.84,90.62 OP.1 62.25,90.93 61.13,89.8 61.13,88.27 60.98,88.12 | R3.2 46.64,63.78 46.64,69.19 R1.2 46.53,69.29 45.82,70.01 45.82,81.95 46.13,82.25 48.27,82.25 | NIT1.1 79.5,83.78 77.76,85.52 71.33,85.52 NIR3.2 71.23,85.62 68.48,85.62 66.74,87.36 61.74,87.36 60.98,88.12 | 60.98,88.12 58.48,85.62 58.48,81.13 58.78,80.82 58.78,80.52 U1.18 | 61.89,13.52 59.8,11.43 PC2.+ | 61.89,13.52 69.6,21.23 74.8,21.23 PR1.2 | v45.72,33.47 44.39,33.47 ENC.15 | v45.72,35.62 45.31,36.02 44.39,36.02 ENC.19 44.39,36.23 44.39,36.74 ENC.20 | 49.39,43.98 49.09,43.98 45.46,40.36 | 49.39,43.98 55.82,43.98 56.64,43.17 60.21,43.17 EL1.1 60.31,43.06 61.23,42.15 61.23,41.02 66.03,36.23 66.33,36.23 67.66,34.9 68.88,34.9 70.42,33.37 70.42,30.31 67.05,26.94 63.17,26.94 58.17,21.94 58.17,17.25 61.89,13.52 | 45.46,40.36 45.21,40.11 44.39,40.11 ENC.25 | 49.24,48.12 49.39,47.96 49.39,43.98 | 49.24,48.12 49.19,48.17 48.07,48.17 47.86,47.96 47.86,46.33 44.39,42.86 44.39,42.05 ENC.28 | 45.46,40.36 v45.72,40.11 | 28.01,15.97 27.96,15.92 27.96,14.9 29.29,13.57 33.17,13.57 PCO.P$1 | 28.01,15.97 28.57,16.53 37.86,16.53 39.29,15.1 44.49,15.1 45.51,16.12 45.51,16.53 PIC33.4
  Top 0.203: ER6.2 29.9,35 29.9,38.17 ER7.2 29.8,38.27 23.57,38.27 | 23.57,38.27 22.66,39.19 WIFI.CH_PD | 23.57,38.27 23.57,36.33 22.66,35.41 22.66,34.29 WIFI.VCC | 28.01,15.97 27.96,16.02 17.14,16.02 11.43,21.74 7.14,21.74 XI.3
  Bottom 0.203: v63.48,74.7 75.31,74.7 79.5,70.52 NIT2.1 79.09,71.03 81.74,73.68 81.74,81.54 79.6,83.68 NIT1.1 | 45.72,35.21 v45.72,35.62 v45.72,40.11 | 45.72,35.21 v45.72,33.47 | XI.3 7.14,21.84 10.21,21.84 22.55,34.19 WIFI.VCC 22.66,34.29 23.57,35.21 45.72,35.21
A0  (via drill 0.35)
  Top 0.203: NIR3.1 71.33,87.46 76.64,87.46 77.97,88.78 81.03,88.78 82.15,87.66 82.15,82.97 78.58,79.39 78.07,79.39 77.25,78.58 77.25,77.56 79.29,75.52 81.03,75.52 81.74,74.8 81.74,69.9 77.25,65.41 77.25,63.27 79.5,61.03 NIT3.2 | v55.21,78.58 55.21,78.48 56.02,77.66 U1.23
  Bottom 0.203: v55.21,78.58 72.76,61.03 79.5,61.03 NIT3.2
A1  (via drill 0.35)
  Top 0.203: IR1.2 13.16,16.63 7.14,16.63 XI.4 | v49.49,77.15 55.41,77.15 U1.24
  Bottom 0.203: v49.49,77.15 49.49,77.56 48.58,78.48 40.62,78.48 13.78,51.64 12.76,51.64 4.18,43.06 4.18,19.59 7.04,16.74 XI.4
A2  (via drill 0.35)
  Top 0.203: IR2.2 13.27,11.53 13.27,9.9 14.19,8.98 14.19,7.86 13.98,7.65 11.02,7.65 7.14,11.53 XI.5 | v52.66,75.01 55.41,75.01 U1.25
  Bottom 0.203: v52.66,75.01 48.78,78.89 40.41,78.89 13.57,52.05 12.55,52.05 3.78,43.27 3.78,14.9 7.04,11.63 XI.5
A3  (via drill 0.35)
  Top 0.203: IR3.2 13.16,6.63 7.14,6.63 XI.6 | v51.74,70.01 56.02,74.29 U1.26
  Bottom 0.203: v51.74,70.01 51.74,66.84 28.98,44.09 10.31,44.09 4.59,38.37 4.59,21.23 7.65,18.16 8.67,18.16 9.49,17.35 9.49,8.98 7.14,6.63 XI.6
A4  (via drill 0.35)
  Top 0.203: R1.1 48.47,69.29 52.05,69.29 v55.72,72.97 56.54,73.78 U1.27
  Bottom 0.203: v55.72,72.97 49.39,79.29 47.45,79.29 46.84,79.91 46.84,80.52 55.92,89.6 57.35,89.6 58.68,90.93 59.7,90.93 OP.3
A5
  Top 0.203: 50.06,66.08 57.15,73.17 U1.28 | 50.06,66.08 48.47,64.5 48.47,63.78 R3.1 | 50.06,66.08 47.55,68.58 47.55,78.07 49.19,79.7 49.19,83.99 51.02,85.82 52.15,85.82 52.66,86.33 52.66,88.07 56.74,92.15 57.66,92.15 58.37,91.44 58.37,90.83 59.7,89.5 59.7,88.58 OP.4
A6
  Top 0.203: U1.19 58.27,79.91 58.27,80.21 57.86,80.62 57.86,87.56 58.37,88.07 58.37,89.8 57.25,90.93 OP.5
A7
  Top 0.203: U1.22 56.54,78.27 56.54,78.48 56.02,78.99 56.02,87.36 57.15,88.48 OP.6
AREF
  Top 0.203: C1.2 48.47,76.44 55.21,76.44 55.62,76.03 55.82,76.03 58.17,78.37 58.17,78.89 57.76,79.29 U1.20
D2  (via drill 0.35)
  Top 0.203: v50.11,61.64 59.39,70.92 U1.32 | v50.11,55.11 38.68,43.68 38.68,40.82 37.96,40.11 37.15,40.11 ENC.4
  Bottom 0.203: v50.11,55.11 v50.11,61.64
D3  (via drill 0.35)
  Top 0.203: v51.84,61.23 61.54,70.92 U1.1
  Bottom 0.203: v51.84,61.23 51.84,54.19 41.43,43.78 41.43,41.23 41.02,40.82 23.57,40.82 22.66,41.74 WIFI.TX
D4  (via drill 0.35)
  Top 0.203: v62.56,63.68 62.56,70.82 62.15,71.23 62.15,71.54 U1.2 | v47.66,40.11 v47.66,41.53
  Bottom 0.203: v62.56,63.68 46.43,47.55 46.43,42.76 v47.66,41.53 | v47.66,40.11 47.66,34.39 46.02,32.76 43.98,32.76 42.55,34.19 25.21,34.19 WIFI.RX
D5
  Top 0.203: OQ3.1 37.45,60.01 38.98,61.54 41.43,61.54 OR3.2 41.53,61.54 42.55,60.52 63.37,60.52 67.76,64.9 67.76,73.58 65.52,75.82 65.52,77.05 U1.9
D6
  Top 0.203: OR2.2 41.43,76.54 40.72,76.54 OQ2.1 37.15,72.86 42.45,67.56 42.45,63.68 45.21,60.92 50.41,60.92 60.41,70.92 60.41,72.86 64.9,77.35 64.9,77.56 U1.10
D7  (via drill 0.35)
  Top 0.203: OQ1.1 37.15,86.03 40.72,89.6 41.23,89.6 OR1.2 41.33,89.6 41.84,89.09 v41.84,88.58 | v64.6,80.72 65.41,79.91 65.41,79.29 64.39,78.27 U1.11
  Bottom 0.203: v64.6,80.72 64.6,87.76 62.45,89.91 61.84,89.91 60.82,90.93 60.82,91.54 60.21,92.15 45.41,92.15 v41.84,88.58
D8  (via drill 0.35)
  Top 0.203: NIR1.1 71.23,58.98 71.23,70.11 70.52,70.82 70.52,73.68 79.19,82.35 80.93,82.35 81.74,83.17 81.74,85.31 79.6,87.46 NIT1.2 | v64.7,79.6 63.88,78.78 U1.12
  Bottom 0.203: v64.7,79.6 71.64,79.6 79.5,87.46 NIT1.2
D9  (via drill 0.35)
  Top 0.203: NIR2.1 71.54,73.17 78.48,73.17 79.5,74.19 NIT2.2 | v62.86,77.97 62.86,78.68 63.17,78.99 63.17,79.29 U1.13
  Bottom 0.203: v62.86,77.97 75.82,77.97 79.5,74.29 NIT2.2
D10  (via drill 0.35)
  Top 0.203: ER7.1 31.74,38.17 34.9,38.17 36.23,36.84 37.04,36.84 ENC.9 37.15,36.84 v38.47,36.84 | v57.56,74.7 62.66,79.8 U1.14
  Bottom 0.203: v57.56,74.7 57.56,59.29 41.84,43.58 41.84,40.21 v38.47,36.84
D11
  Top 0.203: U1.16 61.64,81.03 61.84,81.03 62.25,81.44 64.9,81.44 68.17,78.17 68.17,64.7 52.05,48.58 44.19,48.58 41.43,45.82 41.43,41.23 38.37,38.17 37.15,38.17 ENC.7
D12  (via drill 0.35)
  Top 0.203: v56.84,75.42 61.84,80.42 62.05,80.42 U1.15 | v40.72,41.53 37.96,38.78 37.15,38.78 ENC.6
  Bottom 0.203: v56.84,75.42 56.84,69.39 40.72,53.27 v40.72,41.53
D13  (via drill 0.35)
  Top 0.203: v68.58,49.09 76.74,49.09 R6.1 | v42.55,40.82 41.64,40.82 38.37,37.55 37.25,37.55 37.15,37.45 ENC.8 | v60.41,80.01 59.49,80.93 U1.17
  Bottom 0.203: v42.55,40.82 60.31,40.82 v68.58,49.09 77.97,58.48 79.8,58.48 81.74,60.41 81.74,61.54 80.93,62.35 74.8,62.35 60.41,76.74 v60.41,80.01
DTR  (via drill 0.35)
  Top 0.203: v48.27,77.76 51.74,81.23 51.74,85.01 C2.2 | v13.37,50.92 13.37,42.35 11.53,40.51 PP.1
  Bottom 0.203: v48.27,77.76 40.51,77.76 13.68,50.92 v13.37,50.92
EP4
  Top 0.203: ER2.2 60.31,37.66 60.31,41.33 EL1.2 | EC1.1 52.25,31.53 52.25,32.66 55.01,35.41 55.01,36.64 55.92,37.55 ER1.2 56.02,37.66 60.21,37.66 ER2.2 | U$2.P4 66.33,34.7 64.6,34.7 61.64,37.66 60.41,37.66 ER2.2
GND  (via drill 0.35)  (1 unrouted)
  Top 0.203: 44.85,17.91 44.9,17.96 46.23,17.96 47.25,16.94 47.25,16.63 PIC33.3 | 44.85,17.91 43.88,16.94 43.88,16.63 PIC33.5 | 44.85,17.91 44.8,17.96 44.8,21.94 PD2.A 44.9,22.04 44.9,24.39 v46.43,25.92 | EC4.2 52.15,34.09 v52.15,35.21 52.15,36.74 EC5.2 | 50.41,30.31 50.41,31.43 EC1.2 | 50.41,30.31 50.41,28.78 EC2.2 | v50.82,30.31 50.41,30.31 | U$2.GND 66.44,39.8 69.6,42.96 72.25,42.96 U$2.SHIELD2 72.35,43.06 73.07,43.06 74.09,44.09 76.64,44.09 81.03,39.7 U$2.Y- 80.93,39.49 82.25,40.82 82.25,47.86 81.33,48.78 81.33,49.29 INDL.C 81.33,49.39 81.74,49.8 81.74,61.54 79.6,63.68 79.6,64.8 NIT3.3 79.6,64.9 79.6,67.15 82.15,69.7 82.15,75.42 79.6,77.97 NIT2.3 79.6,78.07 82.56,81.03 82.56,87.86 79.6,90.83 79.6,91.23 NIT1.3 79.39,91.33 76.64,88.58 63.37,88.58 | 63.63,71.69 64.29,72.35 64.29,72.76 63.88,73.17 U1.5 | 63.63,71.69 63.58,71.64 63.37,71.64 62.97,72.05 62.76,72.05 U1.3 62.66,72.15 v61.74,73.07 | 66,64.98 65.92,64.9 65.41,64.9 65.01,64.5 64.6,64.5 63.68,65.41 63.68,71.64 63.63,71.69 | 46.64,80.21 46.64,81.23 C3.1 | 46.64,80.21 46.64,76.54 C1.1 | v56.74,82.97 56.74,79.5 57.15,79.09 57.15,78.78 U1.21 | v47.55,80.21 46.64,80.21 | PJ1.GND 81.03,15.72 82.25,16.94 82.25,21.84 81.33,22.76 81.33,23.27 PL.C 81.23,23.37 79.8,23.37 | 79.8,23.37 77.25,23.37 73.07,27.55 72.35,27.55 U$2.SHIELD1 72.25,27.55 64.39,19.7 59.8,19.7 PC2.- | 79.8,23.37 79.8,29.08 80.82,30.11 80.82,31.23 U$2.G- | 63.37,88.58 62.35,88.58 OP.2 | OQ1.3 37.15,91.13 37.35,91.33 41.23,91.33 OR1.1 41.23,91.23 42.5,89.96 | OR3.1 41.43,63.48 38.98,63.48 37.45,65.01 OQ3.3 | OQ3.3 37.35,65.11 37.35,69.29 34.9,71.74 34.9,75.82 37.04,77.97 OQ2.3 37.15,78.07 37.45,78.37 41.43,78.37 OR2.1 41.53,78.48 42.55,79.5 42.55,89.91 42.5,89.96
  Top 0.203: IR3.1 13.16,8.47 13.16,9.39 12.25,10.31 12.25,12.45 13.16,13.37 IR2.1 13.27,13.47 14.19,14.39 14.19,17.14 13.27,18.06 13.27,18.37 IR1.1 13.16,18.47 7.35,18.47 4.59,21.23 4.59,22.35 7.04,24.8 7.04,26.84 XI.2 | 43.32,35.77 43.27,35.82 43.27,37.15 43.47,37.35 44.29,37.35 ENC.21 44.39,37.45 44.39,38.06 ENC.22 | 43.32,35.77 43.58,35.51 44.29,35.51 ENC.18 | ER5.2 32.45,32.25 32.45,27.86 32.66,27.66 PC1.- | ER5.2 32.45,32.35 33.27,33.17 33.98,33.17 36.23,35.41 37.04,35.41 ENC.11 37.15,35.51 37.96,35.51 38.17,35.72 43.27,35.72 43.32,35.77 | 35.1,44.39 32.04,44.39 EC3.- 31.94,44.39 29.44,41.89 | 35.1,44.39 36.13,44.39 38.27,42.25 38.27,41.64 37.96,41.33 37.15,41.33 ENC.2 | 29.44,41.89 29.39,41.84 25.21,41.84 WIFI.GND | SR.2 2.35,53.47 2.35,52.15 11.43,43.06 PP.2 | 29.44,41.89 30.61,40.72 30.61,34.49 32.55,32.55 ER5.2 | 35.1,44.39 35.1,61.13 38.17,64.19 OQ3.3 | 63.37,88.58 63.37,91.54 61.94,92.97 45.51,92.97 42.5,89.96
  Bottom 0.203: 52.15,30.31 56.94,30.31 66.33,39.7 U$2.GND | 52.15,30.31 v50.82,30.31 v46.43,25.92 | 52.15,30.31 v52.15,35.21 | OP.2 62.25,88.48 v56.74,82.97 54.29,80.52 | v47.55,80.21 53.98,80.21 54.29,80.52 | 54.29,80.52 v61.74,73.07 | U$2.G- 80.82,31.33 80.82,39.39 U$2.Y- | WIFI.GND 23.98,42.96 11.53,42.96 PP.2 11.53,42.86 9.59,40.92 9.59,31.43 7.14,28.98 7.14,26.94 XI.2
LEDA
  Top 0.203: ER8.1 50.41,47.25 75.42,47.25 80.62,42.05 80.82,42.05 U$2.Y+
LEDB  (via drill 0.35)
  Top 0.203: v47.15,47.25 46.23,47.25 ER9.1 | v61.64,43.17 66.54,38.27 67.76,38.27 69.09,36.94 76.54,36.94 81.84,31.64 81.84,29.7 80.93,28.78 U$2.G+
  Bottom 0.203: v47.15,47.25 57.56,47.25 v61.64,43.17
N$1
  Top 0.203: OQ3.2 25.92,62.45 24.59,61.13 17.35,61.13 OD3.A 17.25,61.13 15.92,61.13 12.04,65.01 6.84,65.01 XO.6
N$2
  Top 0.203: PD1.C 64.29,5.51 61.54,5.51 PF1.1
N$3
  Top 0.203: OQ1.2 25.61,88.48 25.51,88.38 17.04,88.38 OD1.A 16.94,88.27 14.08,85.42 6.84,85.42 XO.2
N$4
  Top 0.203: OQ2.2 25.61,75.42 24.08,73.88 17.04,73.88 OD2.A 16.94,73.88 15.72,75.11 6.84,75.11 XO.4
N$5
  Top 0.203: INDL.A 81.23,47.25 76.84,47.25 R6.2
N$6
  Top 0.203: EC2.1 52.25,28.78 54.39,28.78 55.92,30.31 ER4.1 56.02,30.41 60.21,30.41 ER3.1
N$9
  Top 0.203: ER8.2 48.58,47.25 48.58,44.7 45.21,41.33 44.39,41.33 ENC.27
N$10
  Top 0.203: U1.8 65.52,74.91 65.52,74.7 67.15,73.07 67.15,67.05 Q1.3
N$11
  Top 0.203: PL.A 81.23,21.23 76.74,21.23 PR1.1
N$13
  Top 0.203: ENC.1 37.04,41.94 32.35,41.94 32.04,41.64 EC3.+
N$14
  Top 0.203: ER9.2 44.29,47.25 44.29,43.37 43.27,42.35 43.27,41.02 43.58,40.72 44.29,40.72 ENC.26
N$15
  Top 0.203: U1.7 65.01,74.29 65.01,74.09 65.41,73.68 65.41,67.56 64.9,67.05 Q1.1
N$16
  Top 0.203: PD2.C 49.19,21.94 48.98,21.74 48.98,16.63 PIC33.2 48.88,16.53 48.88,16.12 47.45,14.7 38.88,14.7 36.33,12.14 36.33,8.06 33.27,5 PCO.P$2
N$17
  Top 0.203: ER6.1 31.74,35 35.21,35 36.23,36.02 37.04,36.02 ENC.10
N$18
  Top 0.203: PD1.A 68.68,5.51 73.07,5.51 73.37,5.82 79.5,5.82 80.93,4.39 PJ1.VIN0
N$19
  Top 0.203: ER5.1 34.19,32.35 35.92,32.35 37.04,33.47 ENC.14
N$22
  Top 0.203: 50.41,39.39 50.41,41.23 51.13,41.94 Q2.1 | 50.41,39.39 50.41,36.84 EC5.1 | 50.41,39.39 44.39,39.39 ENC.24
N$24
  Top 0.203: ENC.23 44.39,38.68 45.21,38.68 49.8,34.09 50.31,34.09 EC4.1 50.31,34.19 51.13,35 51.13,37.25 54.8,40.92 54.8,41.94 Q2.2
RAW_IV
  Top 0.254: OD1.C 16.94,92.56 8.88,92.56 6.84,90.52 XO.1 6.74,90.42 6.74,88.38 4.39,86.03 4.39,82.86 6.84,80.42 XO.3 6.84,80.21 7.81,79.24 | 7.81,79.24 8.88,78.17 16.94,78.17 OD2.C | OD3.C 17.25,65.41 12.35,65.41 7.65,70.11 6.84,70.11 XO.5 | 7.81,79.24 4.39,75.82 4.39,72.56 6.74,70.21 XO.5 | PF1.2 56.43,5.51 56.43,10.1 50.72,15.82 50.72,16.53 PIC33.1 50.72,16.63 50.72,20.61 50.82,20.72 50.82,23.27 47.45,26.64 40.11,26.64 32.86,19.39 PC1.+ 32.66,19.39 20.1,31.94 14.08,31.94 | 14.08,31.94 7.14,31.94 XI.1 | 14.08,31.94 14.08,52.05 4.39,61.74 4.39,65.62 6.84,68.07 6.84,70.01 XO.5
RD+  (via drill 0.35)
  Top 0.203: v64.5,32.55 64.19,32.86 59.49,32.86 58.88,32.25 56.02,32.25 ER4.2 | ENC.13 37.15,34.09 40.62,34.09 47.35,27.35 66.84,27.35 70.01,30.51 70.01,32.35 68.99,33.37 U$2.RD+
  Bottom 0.203: v64.5,32.55 65.41,32.55 66.23,33.37 68.88,33.37 U$2.RD+
RD-  (via drill 0.35)
  Top 0.203: v61.43,32.15 60.31,32.15 ER3.2 | v42.55,33.17 40.92,34.8 37.15,34.8 ENC.12
  Bottom 0.203: U$2.RD- 66.44,37.15 v61.43,32.15 54.49,25.21 46.13,25.21 42.55,28.78 v42.55,33.17
RESET  (via drill 0.35)
  Top 0.203: v49.49,87.66 48.78,86.95 48.27,86.95 R2.1 48.17,86.84 45.41,84.09 45.41,63.48 46.13,62.76 48.88,62.76 49.19,63.07 49.19,63.88 57.66,72.35 57.66,72.66 U1.29 | v50.52,86.64 51.53,86.64 51.74,86.84 C2.1
  Bottom 0.203: v50.52,86.64 v49.49,87.66 49.49,87.56 48.47,87.56 18.68,57.76 4.18,57.76 3.98,57.96 2.35,57.96 SR.1
RXI  (via drill 0.35)
  Top 0.203: v44.8,62.35 49.09,62.35 49.6,62.86 49.6,63.17 58.27,71.84 58.27,72.05 U1.30
  Bottom 0.203: v44.8,62.35 25.82,62.35 11.53,48.07 PP.4
TD+
  Top 0.203: 67.91,32.09 68.88,31.12 68.88,30.92 U$2.TD+ | 67.91,32.09 66.84,33.17 65.52,33.17 62.86,35.82 60.31,35.82 ER2.1 | 67.91,32.09 63.58,27.76 48.68,27.76 43.27,33.17 43.27,34.49 43.58,34.8 44.29,34.8 ENC.17
TD-
  Top 0.203: U$2.TD- 66.33,32.15 65.92,32.15 64.8,33.27 61.33,33.27 58.78,35.82 56.02,35.82 ER1.1 55.92,35.82 55.92,33.78 52.66,30.51 51.64,30.51 51.43,30.72 51.43,31.94 50.92,32.45 50.41,32.45 48.68,34.19 44.39,34.19 ENC.16
TXO  (via drill 0.35)
  Top 0.203: v45.51,61.64 48.98,61.64 50.01,62.66 50.01,62.76 58.78,71.54 U1.31
  Bottom 0.203: v45.51,61.64 27.55,61.64 11.53,45.62 PP.3

### Text on the board
tPlace: IOTECH © 2018 | IOTB v0.8 TOP | www.iotech.com.tr | S/N:
bPlace: IOTECH | IOTB BOT